# EAGLE design GBA SP Battery Kit (EAGLE 6.2)
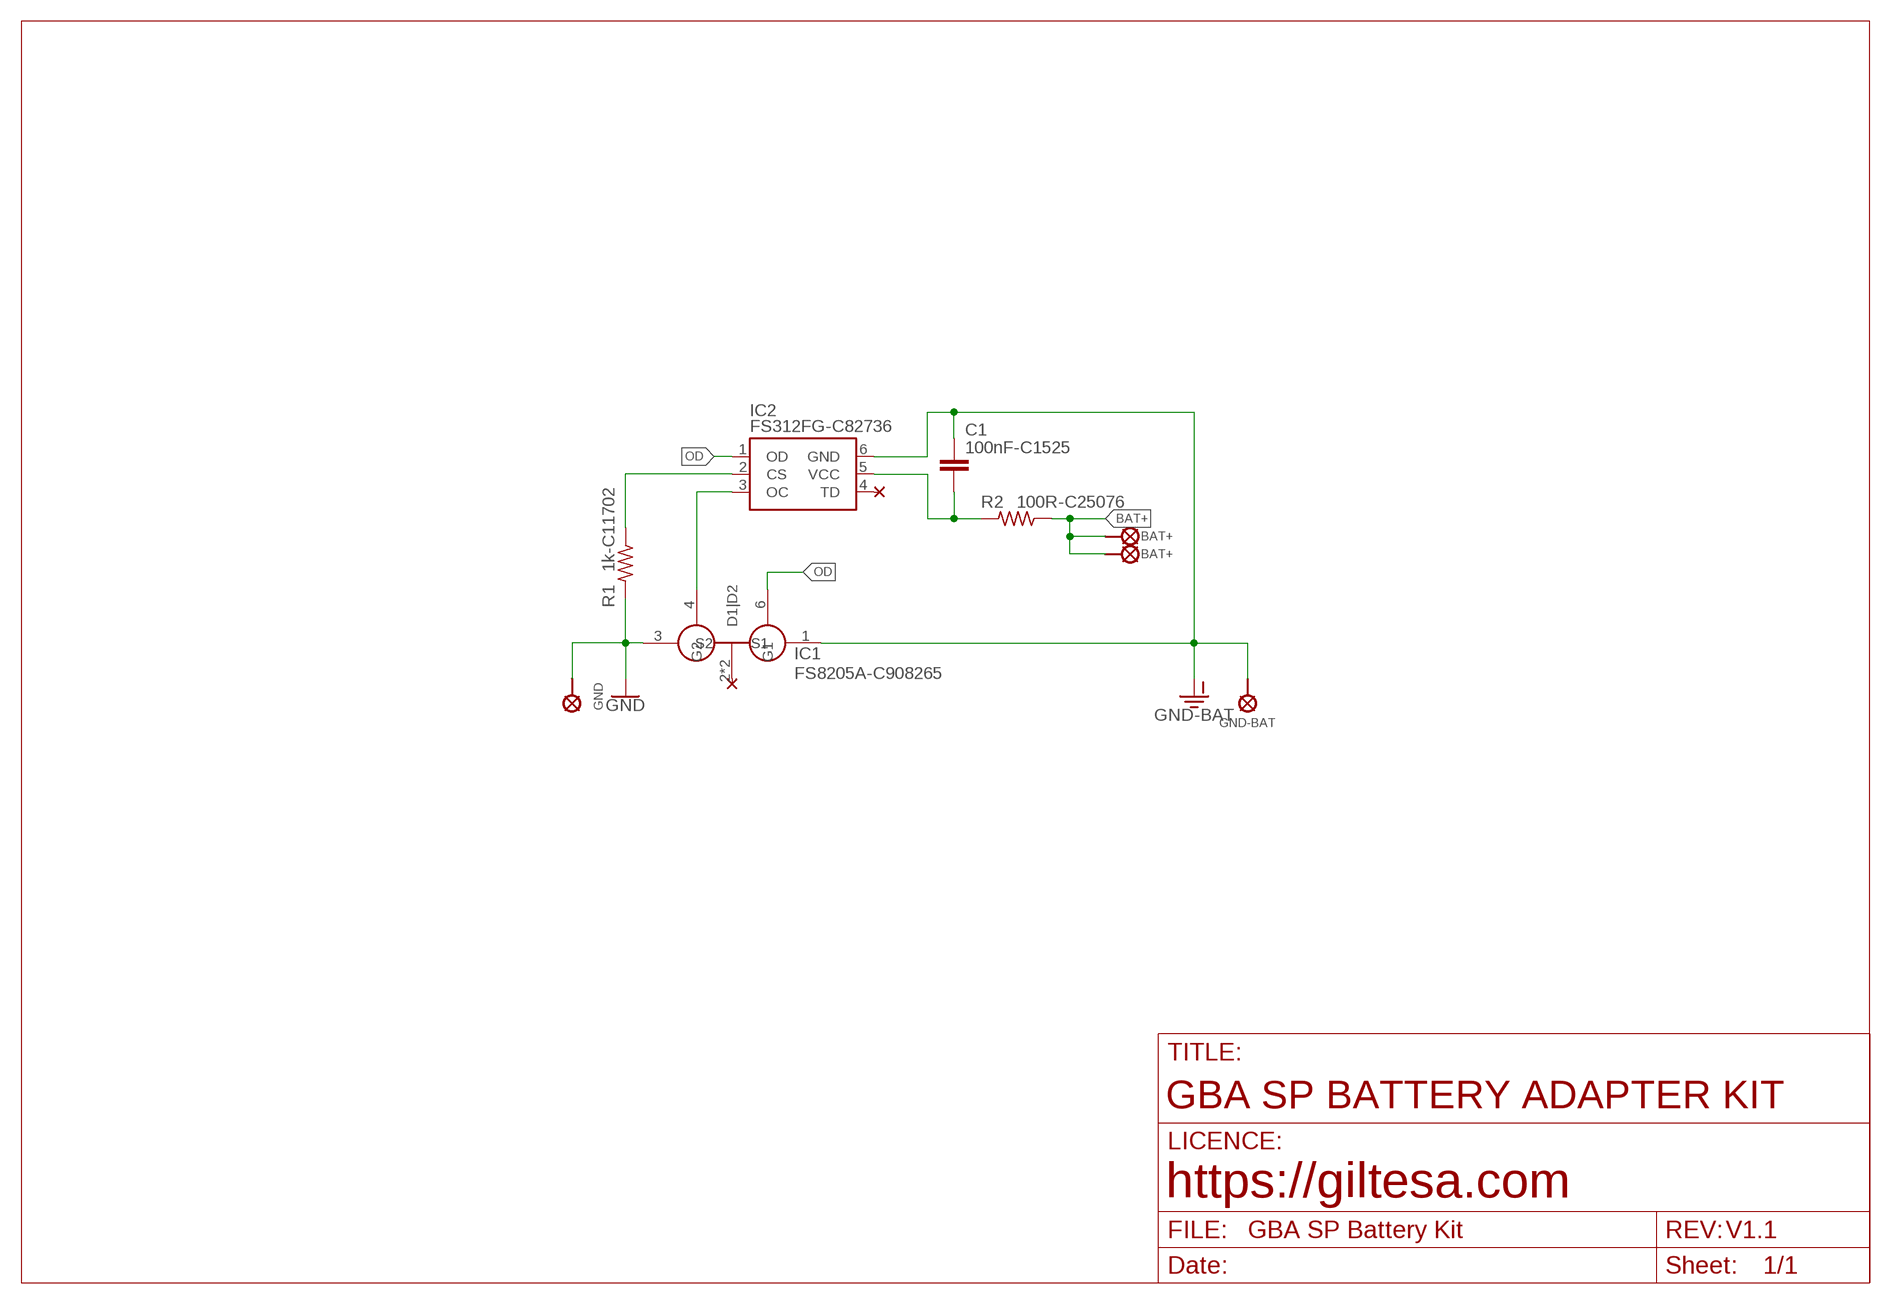
[diagram p0: schematic, sheet 1]

## Parts
C1  100nF-C1525  C0402_S  [C0402_S]
IC1  FS8205A-C908265  FS8205_GBASP  [SOT-23-6_GBASP]
IC2  FS312FG-C82736  FS312FG_GBASP_SHORT  [SOT-23-6_GBASP_SHORT]
R1  1k-C11702  R0402  [R0402]
R2  100R-C25076  R0402  [R0402]
U$2  BAT+  SOLDER_PAD_BATTERY  [BATTERY_SOLDER_PAD]
U$4  GND-BAT  SOLDER_PAD_BATTERY  [BATTERY_SOLDER_PAD]
U$5  GND  SOLDER_PAD_GBASP  [BATTERY_SOLDER_PAD_GBASP]
U$9  BAT+  SOLDER_PAD_GBASP  [BATTERY_SOLDER_PAD_GBASP]

## Nets
BAT+: R2.1 U$2.1 U$9.1
GND: IC1.3(S2) R1.2 U$5.1
GND-BAT: C1.1 IC1.1(S1) IC2.6(GND) U$4.1
N$1: IC2.2(CS) R1.1
N$2: IC1.4(G2) IC2.3(OC)
OD: IC1.6(G1) IC2.1(OD)
VCC-DW: C1.2 IC2.5(VCC) R2.2
Unconnected: IC1.2(D1|D2) IC1.5(D1|D2) IC2.4(TD)

## Notes on the sheet
- GBA SP BATTERY ADAPTER KIT
- https://giltesa.com
- V1.1

## Library data of the parts
C1 = ,giltesa:C0402
IC1 = ,giltesa:FS8205
IC2 = ,giltesa:FS312FG
R1 R2 = ,giltesa:R0402
U$2 U$4 U$5 U$9 = ,giltesa:SOLDER_PAD

## Net classes
1 power: width 0.61 mm, drill 0.406 mm, clearance 0.203 mm
2 gnd: width 0.305 mm, drill 0.406 mm, clearance 0.203 mm
3 power usb: width 0.508 mm, drill 0.406 mm, clearance 0.203 mm

## Board
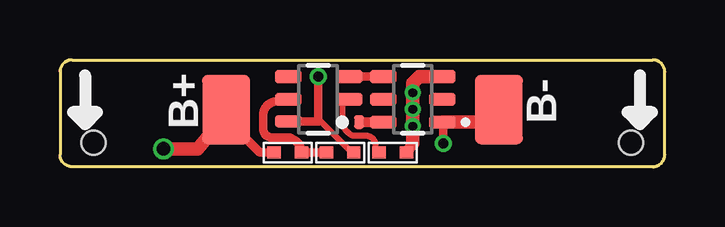
[diagram p1: board, top side]
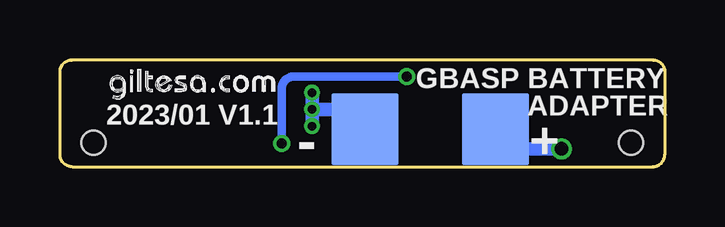
[diagram p2: board, bottom side, seen from below]

Size 25.2 x 4.46 mm. Coordinates in mm from the lower left corner, seen from the top.
Outline: 25.2,0.51 25.2,3.95 arc90 24.69,4.46 0.51,4.46 arc90 0,3.95 0,0.51 arc90 0.51,0 24.69,0 arc90 25.2,0.51
Copper layers (1*16): Top 0.035mm / dielectric 1.6mm / Bottom 0.035mm
Design rules: minimum track width 6mil, minimum drill 12mil, track to track 6mil, track to pad 6mil, pad to pad 6mil, via to via 8mil, smd to smd 0mil, copper to edge 20mil, drill to drill 10mil, minimum pad ring 6mil, minimum via ring 6mil, stop-mask expansion 0mil, vias tented up to drill 100mil, thermal gap 10mil
Holes 1 mm at 23.8,1 1.4,1

### Footprints (pad centres in the part's own frame; a part is rotated, then mirrored left to right if it is on the bottom)
C0402_S = smd 0.559 x 0.5: 1 -0.567,0; 2 0.567,0
SOT-23-6_GBASP = smd 0.55 x 1.1: 1 -0.95,-1.225; 2 0,-1.225; 3 0.95,-1.225; 4 0.95,1.225; 5 0,1.225; 6 -0.95,1.225
SOT-23-6_GBASP_SHORT = smd 0.55 x 0.4: 1 -0.95,-1.705 | smd 0.55 x 1.1: 2 0,-1.3; 3 0.95,-1.3; 4 0.95,1.25; 5 0,1.25 | smd 0.5 x 1.1: 6 -0.925,1.25
R0402 = smd 0.559 x 0.5: 1 -0.567,0; 2 0.567,0
BATTERY_SOLDER_PAD = smd 2 x 2.9: 1 0,0
BATTERY_SOLDER_PAD_GBASP = smd 2.8 x 3: 1 0,0

### Placement (x,y rotation side)
C1  11.67,0.59 180 top
IC1  14.7,2.81 90 top
IC2  10.76,2.81 90 top
R1  13.87,0.59 0 top
R2  9.49,0.59 0 top
U$2  6.92,2.38 180 top
U$4  18.28,2.38 180 top
U$5  12.49,1.57 0 bottom
U$9  7.05,1.57 0 bottom
U$28  [GILTESA.COM_MASK_7MM]  23.17,2.74 0 bottom

### Tracks (layer width: path | path; a pad name or v marks a point on that pad's centre or on a via)
BAT+  (via drill 0.56)
  Top 0.356: R2.1 8.33,0.59 6.92,2 6.92,2.18 | 7.05,1.63 7.05,2.25 U$2.1
  Top 0.508: 6.92,1.79 6.92,2.18 U$2.1
  Top 0.559: v4.31,0.75 5.73,0.75 6.92,2.18
  Bottom 0.508: 6.98,2.18 U$9.1 7.05,0.75
  Bottom 0.559: v4.31,0.75 7.05,0.75
GND  (via drill 0.36)
  Top 0.356: v14.7,3.1 14.68,3.03 14.7,3.05
  Top 0.457: 14.7,0.98 R1.2
  Top 0.559: IC1.3 14.97,3.76 14.7,3.5 14.7,3.05 v14.7,2.4 14.7,0.98
  Bottom 0.406: U$5.1 12.69,1.74 13.35,2.4
  Bottom 0.559: v14.7,2.4 13.35,2.4 | v14.7,1.7 v14.7,3.1
GND-BAT  (via drill 0.41)
  Top 0.254: 10.76,1.95 10.76,1.99 12.15,0.59 C1.1
  Top 0.356: v10.76,3.76 10.76,2.01 10.76,1.95 10.78,1.88 9.46,1.88 IC2.6 | v15.96,0.97 15.96,1.74 arc-90 IC1.1
  Top 0.406: 17.68,1.59 18.28,2.19 U$4.1 17.76,1.86
  Top 0.559: IC1.1 17.76,1.86
  Bottom 0.356: v15.96,0.97 15.96,3.25 arc90 15.46,3.76 v10.76,3.76
N$1
  Top 0.254: IC2.2 11.77,2.72 11.77,1.79 arc50 12.21,1.29 12.76,1.29 arc-90 13.15,0.91 13.15,0.73 R1.1
N$2
  Top 0.356: IC1.4 IC2.3
OD
  Top 0.254: IC2.1 12.56,1.86
  Top 0.406: 12.56,1.86 IC1.6
VCC-DW
  Top 0.356: IC2.5 9.1,2.71 arc90 8.47,2.24 8.47,1.54 arc90 8.85,1.22 9.42,1.22 arc-90 R2.2 C1.2

### Text on the board
tPlace: B+ | B-
bPlace: GBASP BATTERY | ADAPTER | 2023/01 V1.1 | + | -